# Altium schematic sheet Sheet2.SchDoc
size A4
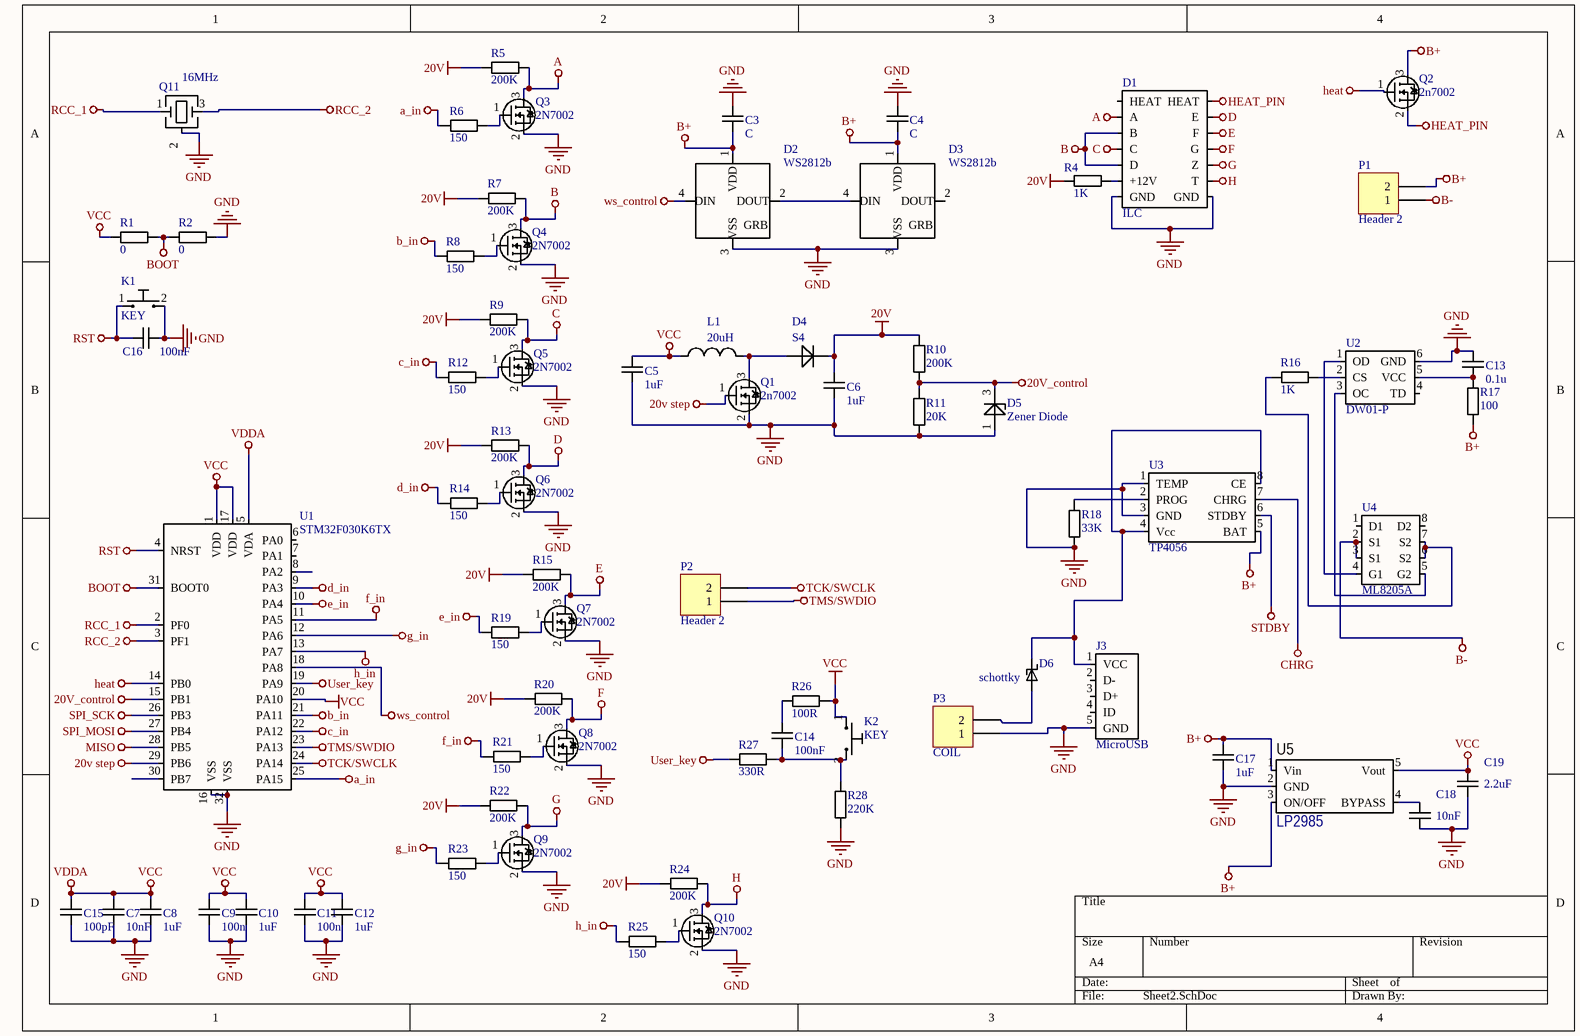
[diagram p0: Sheet2.SchDoc]

## Parts
C3  C  [SMD-0402C]
C4  C  [SMD-0402C]
C5  1uF  [SMD-0402C]
C6  1uF  [SMD-1206C]
C7  10nF  [SMD-0402C]
C8  1uF  [SMD-0402C]
C9  100n  [SMD-0402C]
C10  1uF  [SMD-0402C]
C11  100n  [SMD-0402C]
C12  1uF  [SMD-0402C]
C13  0.1u  [SMD-0402C]
C14  100nF  [SMD-0402C]
C15  100pF  [SMD-0402C]
C16  100nF  [SMD-0402C]
C17  1uF  [SMD-0402C]
C18  10nF  [SMD-0402C]
C19  2.2uF  [SMD-0402C]
D1  ILC  [ILC_1]
D2  WS2812b  [WS2812b]
D3  WS2812b  [WS2812b]
D4  S4  [S4]
D5  Zener Diode  [2n7002]
D6  schottky  [DO-214AC]
J3  MicroUSB  [Micro USB]
K1  KEY  [KEY]
K2  KEY  [KEY]
L1  20uH  [L_0805]
P1  Header 2  [2pin_battarery]
P2  Header 2  [2pin_connector]
P3  COIL  [2pin_connector]
Q1  2n7002  [2n7002]
Q2  2n7002  [2n7002]
Q3  2N7002  [2n7002]
Q4  2N7002  [2n7002]
Q5  2N7002  [2n7002]
Q6  2N7002  [2n7002]
Q7  2N7002  [2n7002]
Q8  2N7002  [2n7002]
Q9  2N7002  [2n7002]
Q10  2N7002  [2n7002]
Q11  16MHz  [Murata Ceramic Resonator]
R1  0  [SMD-0402-RES]
R2  0  [SMD-0402-RES]
R4  1K  [SMD-0402-RES]
R5  200K  [SMD-0402-RES]
R6  150  [SMD-0402-RES]
R7  200K  [SMD-0402-RES]
R8  150  [SMD-0402-RES]
R9  200K  [SMD-0402-RES]
R10  200K  [SMD-0402-RES]
R11  20K  [SMD-0402-RES]
R12  150  [SMD-0402-RES]
R13  200K  [SMD-0402-RES]
R14  150  [SMD-0402-RES]
R15  200K  [SMD-0402-RES]
R16  1K  [SMD-0402-RES]
R17  100  [SMD-0402-RES]
R18  33K  [SMD-0402-RES]
R19  150  [SMD-0402-RES]
R20  200K  [SMD-0402-RES]
R21  150  [SMD-0402-RES]
R22  200K  [SMD-0402-RES]
R23  150  [SMD-0402-RES]
R24  200K  [SMD-0402-RES]
R25  150  [SMD-0402-RES]
R26  100R  [SMD-0402-RES]
R27  330R  [SMD-0402-RES]
R28  220K  [SMD-0402-RES]
U1  STM32F030K6TX  [LQFP-32]
U2  DW01-P  [SOT-23-6]
U3  TP4056  [SOIC8]
U4  ML8205A  [TSSOP-8]
U5  LP2985  [SOT-23-5]

## Nets
20V: C6.1 D4.2 R4.1 R5.2 R7.2 R9.2 R10.1 R13.2 R15.2 R20.2 R22.2 R24.2
20v step: Q1.1 U1.29(PB6)
20V_control: D5.3 R10.2 R11.2 U1.15(PB1)
A: D1.2(A) Q3.3 R5.1
a_in: R6.2 U1.25(PA15)
B: D1.3(B) D1.5(D) Q4.3 R7.1
B+: C3.1 C4.2 C17.2 D2.1(VDD) D3.1(VDD) P1.2 Q2.3 R17.2 U3.5(BAT) U5.1(Vin) U5.3(ON/OFF)
B-: P1.1 U4.2(S1) U4.3(S1)
b_in: R8.2 U1.21(PA11)
BOOT: R1.2 R2.1 U1.31(BOOT0)
C: D1.4(C) Q5.3 R9.1
c_in: R12.2 U1.22(PA12)
CHRG: U3.7(CHRG)
D: D1.13(E) Q6.3 R13.1
d_in: R14.2 U1.9(PA3)
E: D1.12(F) Q7.3 R15.1
e_in: R19.2 U1.10(PA4)
F: D1.11(G) Q8.3 R20.1
f_in: R21.2 U1.11(PA5)
G: D1.10(Z) Q9.3 R22.1
g_in: R23.2 U1.12(PA6)
GND: C3.2 C4.1 C5.1 C6.2 C7.2 C8.1 C9.2 C10.1 C11.2 C12.1 C13.2 C15.1 C16.2 C17.1 C18.1 C19.1 D1.7(GND) D1.8(GND) D2.3(VSS) D3.3(VSS) D5.1 J3.5(GND) K1.2 P3.1 Q1.2 Q3.2 Q4.2 Q5.2 Q6.2 Q7.2 Q8.2 Q9.2 Q10.2 Q11.2 R2.2 R11.1 R18.1 R28.1 U1.16(VSS) U1.32(VSS) U2.6(GND) U3.1(TEMP) U3.3(GND) U5.2(GND)
H: D1.9(T) Q10.3 R24.1
h_in: R25.2 U1.13(PA7)
heat: Q2.1 U1.14(PB0)
HEAT_PIN: D1.14(HEAT) Q2.2
MISO: U1.28(PB5)
RCC_1: Q11.1 U1.2(PF0)
RCC_2: Q11.3 U1.3(PF1)
RST: C16.1 K1.1 U1.4(NRST)
SPI_MOSI: U1.27(PB4)
SPI_SCK: U1.26(PB3)
STDBY: U3.6(STDBY)
TCK/SWCLK: P2.2 U1.24(PA14)
TMS/SWDIO: P2.1 U1.23(PA13)
User_key: R27.1 U1.19(PA9)
VCC: C5.2 C7.1 C8.2 C9.1 C10.2 C11.1 C12.2 C15.2 C19.2 K2.1 L1.1 R1.1 R26.2 U1.1(VDD) U1.5(VDA) U1.17(VDD) U1.20(PA10) U5.5(Vout)  [also labelled VDDA]
ws_control: D2.4(DIN) U1.18(PA8)
NetC13_1: C13.1 R17.1 U2.5(VCC)
NetC14_1: C14.1 K2.2 R27.2 R28.2
NetC14_2: C14.2 R26.1
NetC18_2: C18.2 U5.4(BYPASS)
NetD1_6: D1.6(+12V) R4.2
NetD2_2: D2.2(DOUT) D3.4(DIN)
NetD4_1: D4.1 L1.2 Q1.3
NetD6_A: D6.A P3.2
NetD6_K: D6.K J3.1(VCC) U3.4(Vcc) U3.8(CE)
NetQ3_1: Q3.1 R6.1
NetQ4_1: Q4.1 R8.1
NetQ5_1: Q5.1 R12.1
NetQ6_1: Q6.1 R14.1
NetQ7_1: Q7.1 R19.1
NetQ8_1: Q8.1 R21.1
NetQ9_1: Q9.1 R23.1
NetQ10_1: Q10.1 R25.1
NetR16_1: R16.1 U2.2(CS)
NetR16_2: R16.2 U4.6(S2) U4.7(S2)
NetR18_2: R18.2 U3.2(PROG)
NetU2_1: U2.1(OD) U4.4(G1)
NetU2_3: U2.3(OC) U4.5(G2)

Not connected (* = marked no-connect by the designer): D1 1(HEAT); D3 2(DOUT); J3 2(D-) 3(D+) 4(ID); U1 6(PA0) 7(PA1) 8(PA2) 30(PB7); U2 4(TD); U4 1(D1) 8(D2)

## Notes on the sheet
- (in symbol WS2812b) GRB

## Library data of the parts
C3-C19 = С
D1 = ILC-1.9
D4 = Diode
D5 = BZX84
D6 = SS14
J3 = Micro_USB_female
L1 = L
P1-P3 = Header 2: Header, 2-Pin; LatestRevisionDate: 17-Jul-2002; LatestRevisionNote: Re-released for DXP Platform.; Publisher: Altium Limited
Q11 = Crystal_3
R1 R2 R4-R28 = R
U2 = DW01-P: The DW01-P battery protection IC is designed to / protect lithium-ion/polymer battery from damage or / degrading the lifetime due to overcharge, / overdischarge, and/or overcurrent for one-cell / lithium-ion/polymer battery powered systems, such as / cellular phones.
U3 = TP4056: 1A Standalone Linear Li-lon Battery Charger with Thermal / Regulation in SOP-8
U4 = ML8205A: The ML8205A uses advanced trench technology to